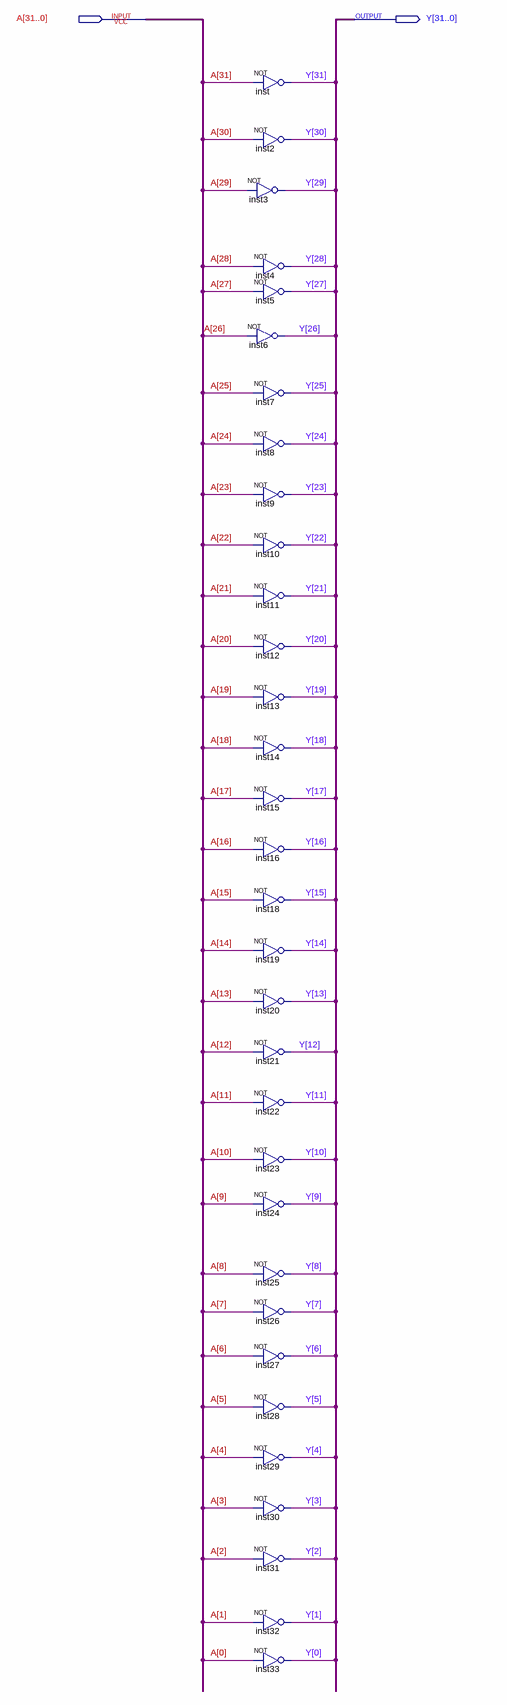
[diagram p0: schematic sheet]
// Quartus schematic NOT_32.bdf as structural Verilog: 32 symbols, 2 pins
module NOT_32 (
  input  [31:0] A,
  output [31:0] Y
);

  not inst (Y[31], A[31]);
  not inst2 (Y[30], A[30]);
  not inst3 (Y[29], A[29]);
  not inst4 (Y[28], A[28]);
  not inst5 (Y[27], A[27]);
  not inst6 (Y[26], A[26]);
  not inst7 (Y[25], A[25]);
  not inst8 (Y[24], A[24]);
  not inst9 (Y[23], A[23]);
  not inst10 (Y[22], A[22]);
  not inst11 (Y[21], A[21]);
  not inst12 (Y[20], A[20]);
  not inst13 (Y[19], A[19]);
  not inst14 (Y[18], A[18]);
  not inst15 (Y[17], A[17]);
  not inst16 (Y[16], A[16]);
  not inst18 (Y[15], A[15]);
  not inst19 (Y[14], A[14]);
  not inst20 (Y[13], A[13]);
  not inst21 (Y[12], A[12]);
  not inst22 (Y[11], A[11]);
  not inst23 (Y[10], A[10]);
  not inst24 (Y[9], A[9]);
  not inst25 (Y[8], A[8]);
  not inst26 (Y[7], A[7]);
  not inst27 (Y[6], A[6]);
  not inst28 (Y[5], A[5]);
  not inst29 (Y[4], A[4]);
  not inst30 (Y[3], A[3]);
  not inst31 (Y[2], A[2]);
  not inst32 (Y[1], A[1]);
  not inst33 (Y[0], A[0]);
endmodule
